# Altium project DoorCard_ReceiverController.PrjPcb
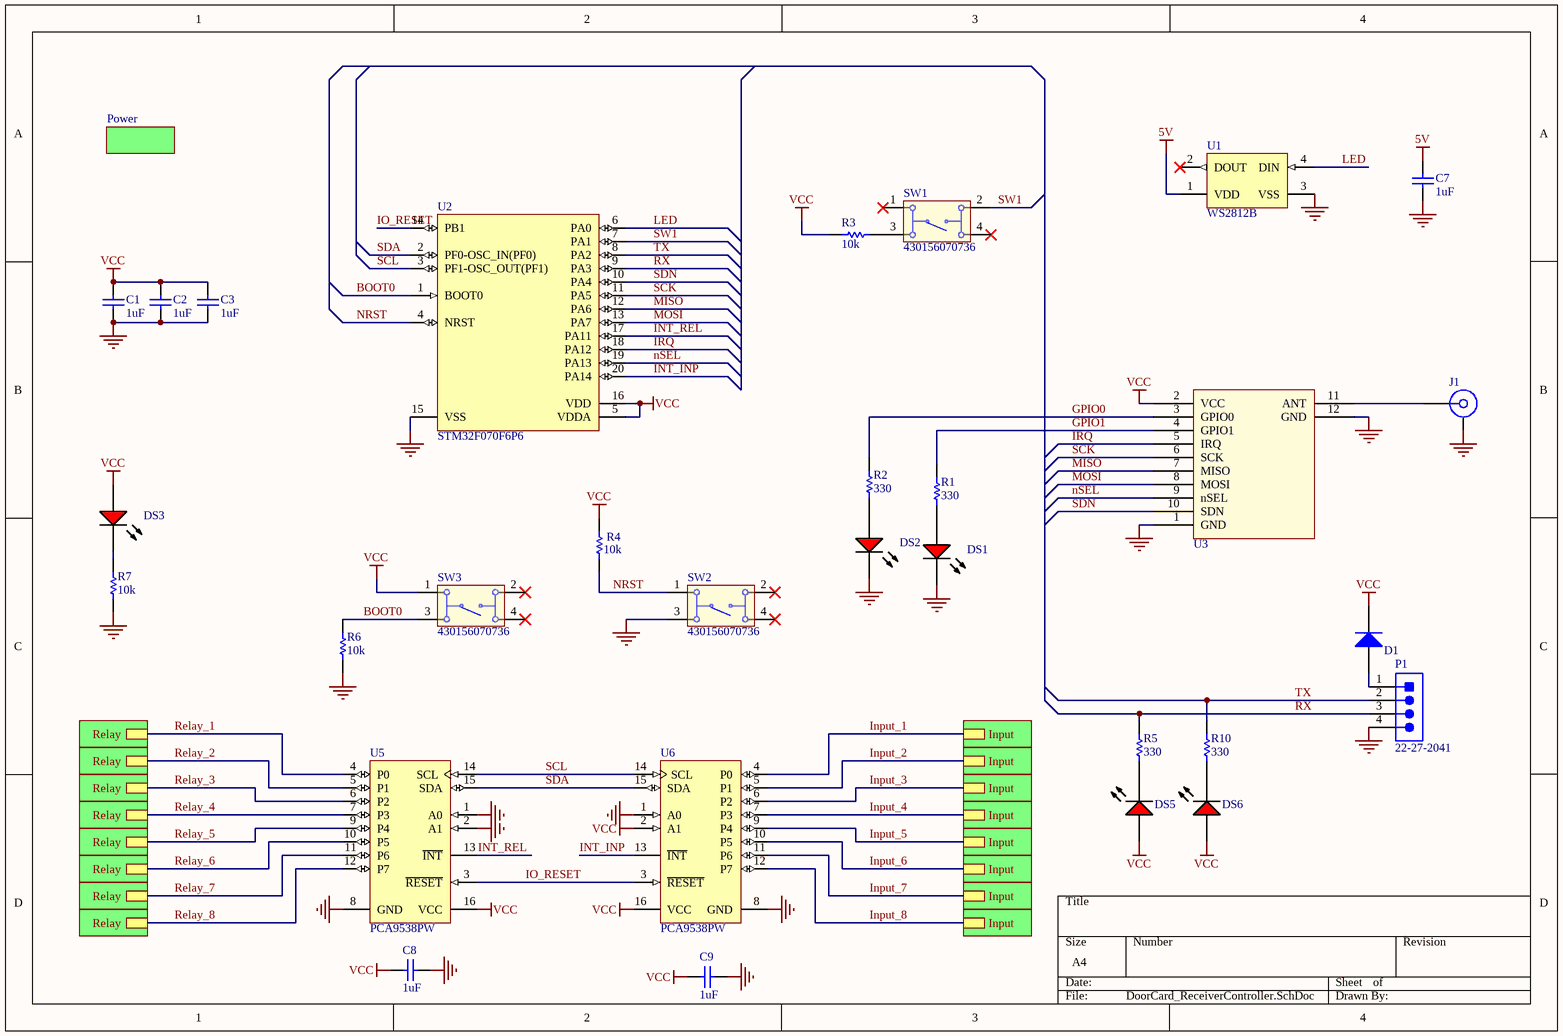
[diagram p0: DoorCard_ReceiverController.SchDoc]
3 sheets, 134 parts. Net scope: hierarchical (ports join the sheet entries above them; power ports are global).
Board file: DoorCardController.PcbDoc
Sheets:
  DoorCard_ReceiverController.SchDoc
    R = Relay.SchDoc
    R = Relay.SchDoc
    R = Relay.SchDoc
    R = Relay.SchDoc
    R = Relay.SchDoc
    R = Relay.SchDoc
    R = Relay.SchDoc
    R = Relay.SchDoc
    I = isolatedInput.SchDoc
    I = isolatedInput.SchDoc
    I = isolatedInput.SchDoc
    I = isolatedInput.SchDoc
    I = isolatedInput.SchDoc
    I = isolatedInput.SchDoc
    I = isolatedInput.SchDoc
    I = isolatedInput.SchDoc

## Sheet DoorCard_ReceiverController.SchDoc
size A4

### Parts
C1  1uF  [CAPC0805(2012)100_M]
C2  1uF  [CAPC0805(2012)100_M]
C3  1uF  [CAPC0805(2012)100_M]
C7  1uF  [CAPC0805(2012)100_M]
C8  1uF  [CAPC0805(2012)100_M]
C9  1uF  [CAPC0805(2012)100_M]
D1  MMSD4148T3G  [ONSC-SOD123-2-425G-04_V]  (value not drawn)
DS1  TLMS1100-GS08  [VISH-TLMX1100_V]  (value not drawn)
DS2  TLMS1100-GS08  [VISH-TLMX1100_V]  (value not drawn)
DS3  TLMS1100-GS08  [VISH-TLMX1100_V]  (value not drawn)
DS5  TLMS1100-GS08  [VISH-TLMX1100_V]  (value not drawn)
DS6  TLMS1100-GS08  [VISH-TLMX1100_V]  (value not drawn)
J1  32K145-400L5  [ROS-32K145-400L5_V]  (value not drawn)
P1  22-27-2041  [MOLX-22-27-2041_V]
R1  330  [RESC0805(2012)_L]
R2  330  [RESC0805(2012)_L]
R3  10k  [RESC0805(2012)_L]
R4  10k  [RESC0805(2012)_L]
R5  330  [RESC0805(2012)_L]
R6  10k  [RESC0805(2012)_L]
R7  10k  [RESC0805(2012)_L]
R10  330  [RESC0805(2012)_L]
SW1  430156070736  [430156070736]
SW2  430156070736  [430156070736]
SW3  430156070736  [430156070736]
U1  WS2812B  [ADAI-WS2812B_V]
U2  STM32F070F6P6  [STM-TSSOP20_M]
U3  Si4463  [E10-433MS]  (value not drawn)
U5  PCA9538PW  [PW16_N]
U6  PCA9538PW  [PW16_N]

### Sub-sheets
Designator = Power (file not in this document): no entries
I = isolatedInput: Input
I = isolatedInput: Input
I = isolatedInput: Input
I = isolatedInput: Input
I = isolatedInput: Input
I = isolatedInput: Input
I = isolatedInput: Input
I = isolatedInput: Input
R = Relay: Relay
R = Relay: Relay
R = Relay: Relay
R = Relay: Relay
R = Relay: Relay
R = Relay: Relay
R = Relay: Relay
R = Relay: Relay

### Nets
5V: C7.2 U1.1(VDD)
GND: C1.1 C2.1 C3.1 C7.1 C8.1 C9.1 DS1.2(K) DS2.2(K) J1.MP P1.4 R6.1 R7.1 SW2.3 U1.3(VSS) U2.15(VSS) U3.1(GND) U3.12(GND) U5.1(A0) U5.2(A1) U5.8(GND) U6.1(A0) U6.8(GND)
VCC: C1.2 C2.2 C3.2 C8.2 C9.2 D1.1(CATHODE) DS3.1(A) DS5.1(A) DS6.1(A) R3.2 R4.2 SW3.1 U2.5(VDDA) U2.16(VDD) U3.2(VCC) U5.16(VCC) U6.2(A1) U6.16(VCC)
BOOT0: R6.2 SW3.3 U2.1(BOOT0)
GPIO0: R2.1 U3.3(GPIO0)
GPIO1: R1.1 U3.4(GPIO1)
Input_1: U6.4(P0) ; sheet I/Input
Input_2: U6.5(P1) ; sheet I/Input
Input_3: U6.6(P2) ; sheet I/Input
Input_4: U6.7(P3) ; sheet I/Input
Input_5: U6.9(P4) ; sheet I/Input
Input_6: U6.10(P5) ; sheet I/Input
Input_7: U6.11(P6) ; sheet I/Input
Input_8: U6.12(P7) ; sheet I/Input
INT_INP: U2.20(PA14) U6.13(~{INT})
INT_REL: U2.17(PA11) U5.13(~{INT})
IO_RESET: U2.14(PB1) U5.3(~{RESET}) U6.3(~{RESET})
IRQ: U2.18(PA12) U3.5(IRQ)
LED: U1.4(DIN) U2.6(PA0)
MISO: U2.12(PA6) U3.7(MISO)
MOSI: U2.13(PA7) U3.8(MOSI)
NRST: R4.1 SW2.1 U2.4(NRST)
nSEL: U2.19(PA13) U3.9(nSEL)
Relay_1: U5.4(P0) ; sheet R/Relay
Relay_2: U5.5(P1) ; sheet R/Relay
Relay_3: U5.6(P2) ; sheet R/Relay
Relay_4: U5.7(P3) ; sheet R/Relay
Relay_5: U5.9(P4) ; sheet R/Relay
Relay_6: U5.10(P5) ; sheet R/Relay
Relay_7: U5.11(P6) ; sheet R/Relay
Relay_8: U5.12(P7) ; sheet R/Relay
RX: P1.3 R5.1 U2.9(PA3)
SCK: U2.11(PA5) U3.6(SCK)
SCL: U2.3(PF1-OSC_OUT(PF1)) U5.14(SCL) U6.14(SCL)
SDA: U2.2(PF0-OSC_IN(PF0)) U5.15(SDA) U6.15(SDA)
SDN: U2.10(PA4) U3.10(SDN)
SW1: SW1.2 U2.7(PA1)
TX: P1.2 R10.1 U2.8(PA2)
NetD1_2: D1.2(ANODE) P1.1
NetDS1_1: DS1.1(A) R1.2
NetDS2_1: DS2.1(A) R2.2
NetDS3_2: DS3.2(K) R7.2
NetDS5_2: DS5.2(K) R5.2
NetDS6_2: DS6.2(K) R10.2
NetJ1_1: J1.1 U3.11(ANT)
NetR3_1: R3.1 SW1.3

Not connected (* = marked no-connect by the designer): SW1 1* 4*; SW2 2* 4*; SW3 2* 4*; U1 2(DOUT)*

### Library data of the parts
C1-C3 C7-C9 = CMP-1036-04754-1: CAP 1uF 25V ±10% 0805 (2012 Metric) Thickness 1mm SMD; Case-EIA: 0805; Case-Metric: 2012; Tolerance: Â±10%; Max Thickness: 1 mm; Value: 1uF; Rated Voltage: 25 V; Technology: SMT
D1 = CMP-0895-00002-1: Switching Diode, 100 V, 200 mA, -55 to 150 degC, 2-Pin SOD123 (425), RoHS, Tape and Reel; Manufacturer: ON Semiconductor; CD (Max): 4 pF; IR @ VR: 75 V (Max)=50 uA; PD (Max): 425 mW; VF (Max): 1 A; Trr (Max): 4 ns; VBR (Min): 100 V; ComponentLink1URL: http://www.onsemi.com/; ComponentLink1Description: Manufacturer URL; PackageReference: SOD123-2-425G-04; PackageDescription: 2-Pin SOD123, Body 2.69 x 1.6 mm, Height 1.35 mm; ComponentLink2Description: Datasheet; Mounting Technology: Surface Mount; RoHS: TRUE; PartNumber: MMSD4148T3G; PackageVersion: Rev. 04G; DatasheetVersion: Rev. 11; Temperature Range: -55 to 150 degC; ComponentLink3Description: Package Specification; Packing: Tape and Reel; ComponentLink3URL: http://www.onsemi.com/pub_link/Collateral/425-04.PDF; ComponentLink2URL: http://www.onsemi.com/pub_link/Collateral/MMSD4148T1-D.PDF
DS1-DS3 DS5 DS6 = CMP-1666-00027-1: LED, RED, 2.1 V, -40 to 100 degC, 2-Pin SMD (0603), RoHS, Tape and Reel; Type (Capacitors): C0G; Resistance: 100000000000 Ohm; Capacitance: 12 pF; Voltage Rating: 50 V; Tolerance: 5%; Min Operating Temperature: -55degC; REACH SVHC: No SVHC; ComponentLink2Description: Datasheet; ComponentLink1URL: http://www.vishay.com/; Width: 0.8 mm; Package Quantity: 4000; PackageReference: TLMX1100; ComponentLink2URL: http://www.vishay.com/docs/83173/tlmb1100.pdf; Case/Package: 0603; Case Code (Metric): 1608; Packaging: Tape and Reel; Pins: 2; ComponentLink1Description: Manufacturer URL; Max Operating Temperature: 125degC; Height: 0.8 mm; Length: 1.6 mm; Mount: Surface Mount; PackageDescription: 2-Pin Surface Mount Device, Body 1.6 x 0.8 mm; DatasheetVersion: Rev. 2.7, 03/2016; Case Code (Imperial): 0603; Voltage Rating (DC): 50 V; RoHSCompliant: True; Radiation Hardening: No
J1 = CMP-0751-00004-2: SMA Right Angle Jack, Edge Mount, Up to 18 GHz, -55 to 155 degC; Manufacturer: Rosenberger; Desgin Note 2: For more information about DRC setting, please look at following webpage, http://techdocs.altium.com/display/SCRT/Design+Rule+for+Edge-Mount+Connectors; Design Note 1: Footprint in library is a generic example - only application specific footprint delivers High Performance; ComponentLink5Description: Webshop / RFQ; ComponentLink5URL: http://www.rosenberger.com/en/contact/sales/; ComponentLink3URL: http://rosenberger.de/ok/images/documents/db/32K145-400L5.pdf; DatasheetVersion: b00; ComponentLink2URL: http://rosenberger.de/ok/images/documents/db/32K145-400L5.pdf; ComponentLink4Description: Series Overview / Design Note; ComponentLink1Description: Manufacturer URL; PackageReference: 32K145-400L5; ComponentLink2Description: Datasheet; PartNumber: 32K145-400L5; PackageVersion: b00; PackageDescription: SMA Right Angle Jack, Edge Mount, 14.25 x 9.5 x 4.46 mm; ComponentLink3Description: Package Specification; ComponentLink1URL: http://www.rosenberger.de; ComponentLink4URL: http://rosenberger.de/ok/images/documents/spez/32.pdf; Mounting Technology: Surface Mount
P1 = CMP-2000-05243-1: Male Header, Pitch 2.54 mm, 1 x 4 Position, Height 11.7 mm, Tail Length 3.56 mm, RoHS, Bulk; Manufacturer: Molex; Voltage rating: 250V; Current rating: 4A; Datasheet Version: Rev. F, 06/2009; Operating temperature: 0degCto+75degC; Contact material: Tinplatedbrass; Manufacturer URL: http://www.molex.com/; Housing material: Nylon(UL94V-0); Datasheet URL: http://www.molex.com/pdm_docs/sd/022272041_sd.pdf
R1-R7 R10 = CMP-1013-00624-1: 10K2 0.125W 1% 0805 (2012 Metric)  SMD; Case-Metric: 2012; Case-EIA: 0805; Value: 10200.00 Ohm; Technology: SMT; Tolerance: 1 %; Power: 0.125 W
SW1-SW3 = CMP-1453-00006-1: WS-TATV THT Tact Switch 6X6 mm; Manufacturer: Wuerth Elektronik; NoPins: 04; ComponentLink2URL: http://katalog.we-online.de/em/datasheet/4301x6.pdf; ComponentLink1Description: Manufacturer URL; PackageReference: 430156070736; ComponentLink2Description: Datasheet; PartNumber: 430156070736; ComponentLink1URL: http://www.we-online.com
U1 = CMP-1740-00005-1: Intelligent Control LED Integrated Light Source, 3.5 to 5.3 V, -25 to 80 degC, 4-Pin SMD, RoHS, Bulk; Case\Package: Radial; Shielding: Unshielded; Current Rating: 240 mA; Tolerance: 10%; Mount: Through Hole; Max Operating Temperature: 125 degC; Radiation Hardening: No; Length: 12.2 mm; Min Operating Temperature: -55 degC; ComponentLink1URL: https://www.adafruit.com/; Packaging: Bulk; Lead Pitch: 5 mm; RoHSCompliant: true; Pins: 2; Package Quantity: 200; ComponentLink2URL: https://cdn-shop.adafruit.com/datasheets/WS2812B.pdf; ComponentLink2Description: Datasheet; PackageDescription: 4-Pin Surface Mount Device, Body 5 x 5 mm, Pitch 3.3 mm; PackageReference: WS2812B; Height: 12.2 mm; REACH SVHC: No SVHC; ComponentLink1Description: Manufacturer URL; DatasheetVersion: May-13
U2 = CMP-0304-00145-2: ARM Cortex-M0 32-bit MCU, 32 KB Flash, 6 KB Internal RAM, 15 I/Os, 20-Pin TSSOP, -40 to 85 degC, Tray; Manufacturer: STMicroelectronics; FLASH Size (Prog) (kB): 32; Internal RAM Size (kB): 6; Operating Frequency(F) (Processor speed) (MHz): 48; Supply Voltage(Vcc) min (V): 2.4; I/Os (High Current): 15; ComponentLink2URL: http://www.st.com/st-web-ui/static/active/en/resource/technical/document/datasheet/DM00141386.pdf; ComponentLink2Description: Datasheet; Packing: Tray; DatasheetVersion: Rev. 3; PartNumber: STM32F070F6P6; Core: ARM Cortex-M0; Package Reference: TSSOP20; Package Description: 20-Pin Thin Shrink Small Outline Package, Body 6.5 x 4.4 mm, Pitch 0.65 mm; ComponentLink1Description: Manufacturer URL; ComponentLink1URL: http://www.st.com/; Mounting Technology: Surface Mount
U3 = Component_1: E10-433MS
U5 U6 = CMP-0314-00266-1: Remote 8-Bit I2C and SMBus Low-Power I/O Expander with Interrupt Output, Reset, and Config Registers, 2.3 to 5.5 V, -40 to 85 degC, 16-pin TSSOP (PW), Green (RoHS & no Sb/Br); Manufacturer: Texas Instruments; Push-Pull I/O Type: Yes; VCC(Min)(V): 2.3; SubFamily: I2C IO Expander; fSCLK(Max)(MHz): 0.1, 0.4; Technology Family: I2C, SMBus; Max Frequency(kHz): 400; VCC(Max)(V): 5.5; I2C Address: 1110 0xx; # of I/Os: 8; Vcc range(V): 2.3 to 5.5; Configuration Registers: Yes; DatasheetVersion: SCPS126E; PackageDescription: 16-Pin Plastic Thin Small Outline Package 5 x 4.4 mm Body ,0.65 mm Pitch; PartNumber: PCA9538PW; ComponentLink1URL: http://www.ti.com/general/docs/lit/getliterature.tsp?genericPartNumber=PCA9538&fileType=pdf; 5V Tolerant I/O: Yes; Interrupt Output: Yes; Code_JEDEC: MO-153; ComponentLink1Description: Datasheet; PackageVersion: revG, Feb-2011; Low Power: Yes; Mounting Technology: Surface Mount; Reset Input: Yes; PackageReference: PW16; Eco-Plan: Green (RoHS & no Sb/Br)

## Sheet Relay.SchDoc
size A4
Used 8 times, as channels R, R, R, R, R, R, R, R. Parts and nets are listed once, with the designators drawn on the sheet.
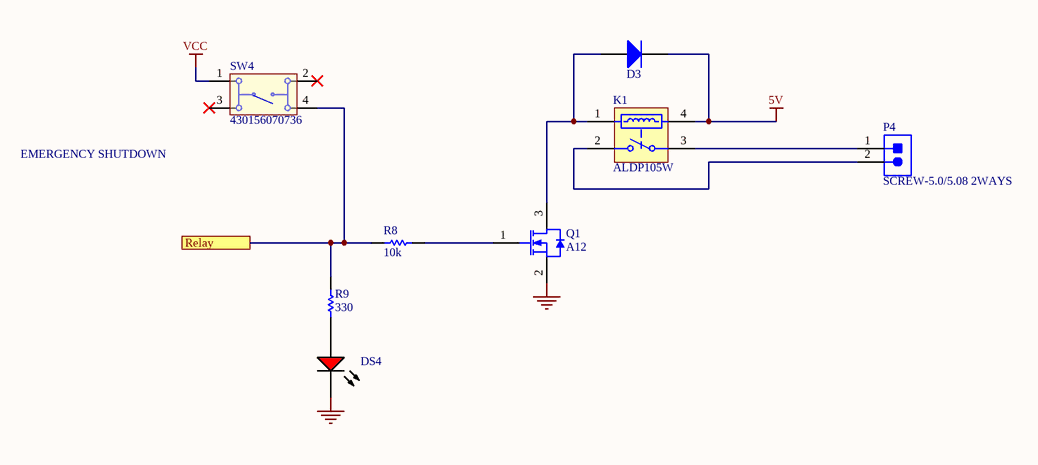
[diagram p1: Relay.SchDoc]

### Parts
D3  MMSD4148T3G  [ONSC-SOD123-2-425G-04_V]  (value not drawn)
DS4  TLMS1100-GS08  [VISH-TLMX1100_V]  (value not drawn)
K1  ALDP105W  [PNSC-LD-P-4-2050x720x1530_V]
P4  SCREW-5.0/5.08 2WAYS  [SCREW-5.0-2WAYS_V]
Q1  A12  [INTR-SOT-23-3_V]
R8  10k  [RESC0805(2012)_L]
R9  330  [RESC0805(2012)_L]
SW4  430156070736  [430156070736]

### Ports
Relay

### Nets
5V: D3.1(CATHODE) K1.4
GND: DS4.2(K) Q1.2(S)
VCC: SW4.1
Relay: R8.2 R9.1 SW4.4 ; port Relay
NetD3_2: D3.2(ANODE) K1.1 Q1.3(D)
NetDS4_1: DS4.1(A) R9.2
NetK1_2: K1.2(NO) P4.2
NetK1_3: K1.3(COM) P4.1
NetQ1_1: Q1.1(G) R8.1

Not connected (* = marked no-connect by the designer): SW4 2* 3*

### Channels
R: designators end in _R8; ports Relay=Relay_1
R: designators end in _R7; ports Relay=Relay_2
R: designators end in _R6; ports Relay=Relay_3
R: designators end in _R5; ports Relay=Relay_4
R: designators end in _R4; ports Relay=Relay_5
R: designators end in _R3; ports Relay=Relay_6
R: designators end in _R2; ports Relay=Relay_7
R: designators end in _R1; ports Relay=Relay_8

### Notes on the sheet
- EMERGENCY SHUTDOWN

### Library data of the parts
D3 = CMP-0895-00002-1: as D1 on sheet DoorCard_ReceiverController; ComponentLink1URL: http://www.onsemi.com/; ComponentLink1Description: Manufacturer URL; PackageReference: SOD123-2-425G-04; PackageDescription: 2-Pin SOD123, Body 2.69 x 1.6 mm, Height 1.35 mm; ComponentLink2Description: Datasheet; Mounting Technology: Surface Mount; RoHS: TRUE; PartNumber: MMSD4148T3G; PackageVersion: Rev. 04G; DatasheetVersion: Rev. 11; Temperature Range: -55 to 150 degC; ComponentLink3Description: Package Specification; Packing: Tape and Reel; ComponentLink3URL: http://www.onsemi.com/pub_link/Collateral/425-04.PDF; ComponentLink2URL: http://www.onsemi.com/pub_link/Collateral/MMSD4148T1-D.PDF
DS4 = CMP-1666-00027-1: as DS1 on sheet DoorCard_ReceiverController; Min Operating Temperature: -55degC; REACH SVHC: No SVHC; ComponentLink2Description: Datasheet; ComponentLink1URL: http://www.vishay.com/; Width: 0.8 mm; Package Quantity: 4000; PackageReference: TLMX1100; ComponentLink2URL: http://www.vishay.com/docs/83173/tlmb1100.pdf; Case/Package: 0603; Case Code (Metric): 1608; Packaging: Tape and Reel; Pins: 2; ComponentLink1Description: Manufacturer URL; Max Operating Temperature: 125degC; Height: 0.8 mm; Length: 1.6 mm; Mount: Surface Mount; PackageDescription: 2-Pin Surface Mount Device, Body 1.6 x 0.8 mm; DatasheetVersion: Rev. 2.7, 03/2016; Case Code (Imperial): 0603; Voltage Rating (DC): 50 V; RoHSCompliant: True; Radiation Hardening: No
K1 = CMP-1503-00163-1: LD-P Relays, 5 V Coil Voltage, 200 mW Nominal Operating Power, -40 to 85 degC, 4-Pin LD-P, Carton, Case, RoHS; Manufacturer: Panasonic; Mechanical Life(Min.operation): 5x10^6; Max Switching Current: 5 A AC, 3 A DC; Pb-Free: True; Electrical Life: 2x10^5; Coil Voltage: 5 V; Max Switching Voltage: 277 V AC, 30 V DC; Nominal Operating Power: 200 mW; ComponentLink3Description: Package Specification; PackageVersion: ASCTB193E, 02/2014; ComponentLink1URL: http://www3.panasonic.biz/ac/ae/index.jsp; Mounting Technology: Through Hole; Packing: Carton, Case; PackageDescription: 4-Pin Through Hole Terminal Package, Body 20.5 x 7.2 mm; ComponentLink2Description: Datasheet; RoHS: True; Series: LD-P Relays; ComponentLink1Description: Manufacturer URL; ComponentLink2URL: http://www3.panasonic.biz/ac/e_download/control/relay/power/catalog/mech_eng_ldp.pdf?f_cd=300242; PartNumber: ALDP105W; DatasheetVersion: 201402-T; PackageReference: LD-P-4-2050x720x1530; ComponentLink3URL: http://www3.panasonic.biz/ac/e_download/control/relay/power/catalog/mech_eng_ldp.pdf?f_cd=300242
P4 = CMP-0617-00009-1: Socket, Screw Terminal Block, 2 Way, 5.0 mm Pitch, 90 Degree Angle, Through-Hole; Manufacturer: No Vendor; Insulation Resistance: 5000 MOhm / 1000 V; Contact Resistance: 20 mOhm; Rated Current: 25 A; Poles: 2; Rated Voltage: 300 V; PartNumber: SCREW-5.0/5.08 2WAYS; ComponentLink1Description: Datasheet; ComponentLink1URL: 5mm screw terminal in SVN; Mounting Technology: Through Hole; PackageDescription: Socket, Screw Terminal Block, 2 Way, Pitch 5 mm, 90 Degree Angle, Through-Hole; Temperature Range: -40 to 105 degC
Q1 = CMP-2000-04985-1: IRLML2502TRPBF, N-Channel HEXFET(R) Power MOSFET, 20 V VDS, +/- 12 V VGS, 4.2 A, 3-Pin SOT23, RoHS, Tape and Reel; Manufacturer: International Rectifier; Drain-to-Source Voltage [Vdss]: 20V; Drain-Source On Resistance-Max: 0.045O; Qg Gate Charge: 8nC; Rated Power Dissipation: 1.25W; Package Reference: SOT-23-3; Manufacturer URL: http://internationalrectifier.com/; Package Description: 3-Pin Small Outline Transistor, Body 2.92 x 1.3 mm, Pitch 0.95 mm; Datasheet Version: Apr-14; Channel Type: N-Channel; Datasheet URL: https://datasheet.ciiva.com/6383/irlml2502pbf-6383216.pdf
R8 R9 = CMP-1013-00624-1: as R1 on sheet DoorCard_ReceiverController; Technology: SMT; Tolerance: 1 %; Power: 0.125 W
SW4 = CMP-1453-00006-1: as SW1 on sheet DoorCard_ReceiverController; ComponentLink2URL: http://katalog.we-online.de/em/datasheet/4301x6.pdf; ComponentLink1Description: Manufacturer URL; PackageReference: 430156070736; ComponentLink2Description: Datasheet; PartNumber: 430156070736; ComponentLink1URL: http://www.we-online.com

## Sheet isolatedInput.SchDoc
size A4
Used 8 times, as channels I, I, I, I, I, I, I, I. Parts and nets are listed once, with the designators drawn on the sheet.
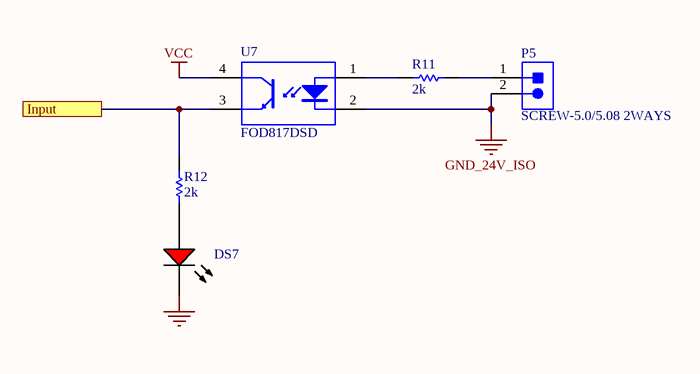
[diagram p2: isolatedInput.SchDoc]

### Parts
DS7  TLMS1100-GS08  [VISH-TLMX1100_V]  (value not drawn)
P5  SCREW-5.0/5.08 2WAYS  [SCREW-5.0-2WAYS_V]
R11  2k  [RESC0805(2012)_L]
R12  2k  [RESC0805(2012)_L]
U7  FOD817DSD  [FAIR-MDIP-4_V]

### Ports
Input

### Nets
GND: DS7.2(K)
GND_24V_ISO: P5.2 U7.2(CATHODE)
VCC: U7.4(COLLECTOR)
Input: R12.1 U7.3(EMITTER) ; port Input
NetDS7_1: DS7.1(A) R12.2
NetP5_1: P5.1 R11.1
NetR11_2: R11.2 U7.1(ANODE)

### Channels
I: designators end in _I8; ports Input=Input_1
I: designators end in _I7; ports Input=Input_2
I: designators end in _I6; ports Input=Input_3
I: designators end in _I5; ports Input=Input_4
I: designators end in _I4; ports Input=Input_5
I: designators end in _I3; ports Input=Input_6
I: designators end in _I2; ports Input=Input_7
I: designators end in _I1; ports Input=Input_8

### Library data of the parts
DS7 = CMP-1666-00027-1: as DS1 on sheet DoorCard_ReceiverController; Min Operating Temperature: -55degC; REACH SVHC: No SVHC; ComponentLink2Description: Datasheet; ComponentLink1URL: http://www.vishay.com/; Width: 0.8 mm; Package Quantity: 4000; PackageReference: TLMX1100; ComponentLink2URL: http://www.vishay.com/docs/83173/tlmb1100.pdf; Case/Package: 0603; Case Code (Metric): 1608; Packaging: Tape and Reel; Pins: 2; ComponentLink1Description: Manufacturer URL; Max Operating Temperature: 125degC; Height: 0.8 mm; Length: 1.6 mm; Mount: Surface Mount; PackageDescription: 2-Pin Surface Mount Device, Body 1.6 x 0.8 mm; DatasheetVersion: Rev. 2.7, 03/2016; Case Code (Imperial): 0603; Voltage Rating (DC): 50 V; RoHSCompliant: True; Radiation Hardening: No
P5 = CMP-0617-00009-1: as P4 on sheet Relay; PartNumber: SCREW-5.0/5.08 2WAYS; ComponentLink1Description: Datasheet; ComponentLink1URL: 5mm screw terminal in SVN; Mounting Technology: Through Hole; PackageDescription: Socket, Screw Terminal Block, 2 Way, Pitch 5 mm, 90 Degree Angle, Through-Hole; Temperature Range: -40 to 105 degC
R11 R12 = CMP-1013-00624-1: as R1 on sheet DoorCard_ReceiverController; Technology: SMT; Tolerance: 1 %; Power: 0.125 W
U7 = CMP-2000-06281-1: Phototransistor Optocoupler, 4 us Rise, 3 us Fall, 5000 Vrms, -55 to 110 degC, 4-Pin MDIP, RoHS, Tape and Reel; Manufacturer: Fairchild Semiconductor; Current Transfer Ratio (Min): 300%@5mA; Rise / Fall Time (Typ): 4µs,3µs; Vce Saturation (Max): 200mV; Current Transfer Ratio (Max): 600%@5mA; Package Version: 10/2014; Current - DC Forward (If) (Max): 50mA; Online Catalog: FOD617,814,817Series; Voltage - Output (Max): 70V; Number of Channels: 1; Input Type: DC; Voltage - Forward (Vf) (Typ): 1.2V; Other Names: FOD817DSDDKR; Output Type: Transistor; Packaging: Digi-Reel®; Category: Isolators; Package / Case: 4-SMD,GullWing; Voltage - Isolation: 5000Vrms; Mounting Technology: SurfaceMount; Series: -; Mounting Type: SurfaceMount; Supplier Device Package: 4-SMD; Family: Optoisolators-Transistor,PhotovoltaicOutput; Standard Package: 1; Package Description: 4-Pin Surface Mount Device, Body 6.5 x 4.6 mm, Pitch 2.54 mm; Datasheet Version: Rev. 2.8, 11/2015; Package Reference: MDIP 4L; Manufacturer URL: https://www.fairchildsemi.com/; Current - Output / Channel: 50mA; Turn On / Turn Off Time (Typ): -; Operating Temperature: -55°C~110°C; Datasheet URL: https://www.fairchildsemi.com/datasheets/FO/FOD817D.pdf; Package URL: https://www.fairchildsemi.com/package-drawings/N0/N04C.pdf

## Nets that join several sheets
5V: DoorCard_ReceiverController (C7.2 U1.1), R (D3_R8.1 K1_R8.4), R (D3_R7.1 K1_R7.4), R (D3_R6.1 K1_R6.4), R (D3_R5.1 K1_R5.4), R (D3_R4.1 K1_R4.4), R (D3_R3.1 K1_R3.4), R (D3_R2.1 K1_R2.4), R (D3_R1.1 K1_R1.4)
GND: DoorCard_ReceiverController (22 pins), R (DS4_R8.2 Q1_R8.2), R (DS4_R7.2 Q1_R7.2), R (DS4_R6.2 Q1_R6.2), R (DS4_R5.2 Q1_R5.2), R (DS4_R4.2 Q1_R4.2), R (DS4_R3.2 Q1_R3.2), R (DS4_R2.2 Q1_R2.2), R (DS4_R1.2 Q1_R1.2), I (DS7_I8.2), I (DS7_I7.2), I (DS7_I6.2), I (DS7_I5.2), I (DS7_I4.2), I (DS7_I3.2), I (DS7_I2.2), I (DS7_I1.2)
GND_24V_ISO: I (P5_I8.2 U7_I8.2), I (P5_I7.2 U7_I7.2), I (P5_I6.2 U7_I6.2), I (P5_I5.2 U7_I5.2), I (P5_I4.2 U7_I4.2), I (P5_I3.2 U7_I3.2), I (P5_I2.2 U7_I2.2), I (P5_I1.2 U7_I1.2)
VCC: DoorCard_ReceiverController (18 pins), R (SW4_R8.1), R (SW4_R7.1), R (SW4_R6.1), R (SW4_R5.1), R (SW4_R4.1), R (SW4_R3.1), R (SW4_R2.1), R (SW4_R1.1), I (U7_I8.4), I (U7_I7.4), I (U7_I6.4), I (U7_I5.4), I (U7_I4.4), I (U7_I3.4), I (U7_I2.4), I (U7_I1.4)
Input_1: DoorCard_ReceiverController (U6.4), I (R12_I8.1 U7_I8.3)
Input_2: DoorCard_ReceiverController (U6.5), I (R12_I7.1 U7_I7.3)
Input_3: DoorCard_ReceiverController (U6.6), I (R12_I6.1 U7_I6.3)
Input_4: DoorCard_ReceiverController (U6.7), I (R12_I5.1 U7_I5.3)
Input_5: DoorCard_ReceiverController (U6.9), I (R12_I4.1 U7_I4.3)
Input_6: DoorCard_ReceiverController (U6.10), I (R12_I3.1 U7_I3.3)
Input_7: DoorCard_ReceiverController (U6.11), I (R12_I2.1 U7_I2.3)
Input_8: DoorCard_ReceiverController (U6.12), I (R12_I1.1 U7_I1.3)
Relay_1: DoorCard_ReceiverController (U5.4), R (R8_R8.2 R9_R8.1 SW4_R8.4)
Relay_2: DoorCard_ReceiverController (U5.5), R (R8_R7.2 R9_R7.1 SW4_R7.4)
Relay_3: DoorCard_ReceiverController (U5.6), R (R8_R6.2 R9_R6.1 SW4_R6.4)
Relay_4: DoorCard_ReceiverController (U5.7), R (R8_R5.2 R9_R5.1 SW4_R5.4)
Relay_5: DoorCard_ReceiverController (U5.9), R (R8_R4.2 R9_R4.1 SW4_R4.4)
Relay_6: DoorCard_ReceiverController (U5.10), R (R8_R3.2 R9_R3.1 SW4_R3.4)
Relay_7: DoorCard_ReceiverController (U5.11), R (R8_R2.2 R9_R2.1 SW4_R2.4)
Relay_8: DoorCard_ReceiverController (U5.12), R (R8_R1.2 R9_R1.1 SW4_R1.4)